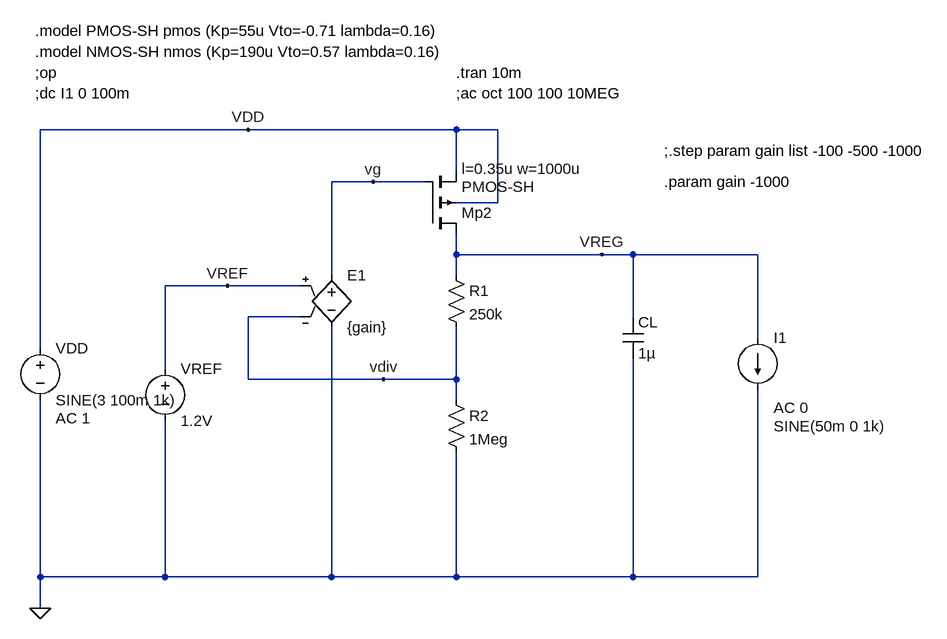
[diagram p0: schematic 5_Voltage_regulator.asc]
5_Voltage_regulator.asc, the LTspice schematic file:
Version 4
SHEET 1 1092 740
WIRE -880 -16 -1200 -16
WIRE -560 -16 -880 -16
WIRE -496 -16 -560 -16
WIRE -560 48 -560 -16
WIRE -688 64 -752 64
WIRE -608 64 -688 64
WIRE -496 96 -496 -16
WIRE -496 96 -560 96
WIRE -560 176 -560 144
WIRE -336 176 -560 176
WIRE -288 176 -336 176
WIRE -96 176 -288 176
WIRE -752 208 -752 64
WIRE -560 208 -560 176
WIRE -912 224 -1008 224
WIRE -800 224 -912 224
WIRE -800 272 -880 272
WIRE -288 272 -288 176
WIRE -96 304 -96 176
WIRE -1200 320 -1200 -16
WIRE -1008 352 -1008 224
WIRE -880 368 -880 272
WIRE -672 368 -880 368
WIRE -560 368 -560 288
WIRE -560 368 -672 368
WIRE -560 400 -560 368
WIRE -1200 672 -1200 400
WIRE -1008 672 -1008 432
WIRE -1008 672 -1200 672
WIRE -752 672 -752 288
WIRE -752 672 -1008 672
WIRE -560 672 -560 480
WIRE -560 672 -752 672
WIRE -288 672 -288 336
WIRE -288 672 -560 672
WIRE -96 672 -96 384
WIRE -96 672 -288 672
WIRE -1200 720 -1200 672
FLAG -1200 720 0
FLAG -880 -16 VDD
FLAG -912 224 VREF
FLAG -336 176 VREG
FLAG -688 64 vg
FLAG -672 368 vdiv
SYMBOL pmos4 -608 144 M180
WINDOW 123 56 100 Left 2
SYMATTR Value2 l=0.35u w=1000u
SYMATTR InstName Mp2
SYMATTR Value PMOS-SH
SYMBOL voltage -1200 304 R0
WINDOW 123 24 124 Left 2
WINDOW 39 0 0 Left 2
SYMATTR Value2 AC 1
SYMATTR InstName VDD
SYMATTR Value SINE(3 100m 1k)
SYMBOL e -752 192 R0
SYMATTR InstName E1
SYMATTR Value {gain}
SYMBOL res -576 192 R0
SYMATTR InstName R1
SYMATTR Value 250k
SYMBOL res -576 384 R0
SYMATTR InstName R2
SYMATTR Value 1Meg
SYMBOL voltage -1008 336 R0
WINDOW 123 0 0 Left 2
WINDOW 39 0 0 Left 2
SYMATTR InstName VREF
SYMATTR Value 1.2V
SYMBOL cap -304 272 R0
SYMATTR InstName CL
SYMATTR Value 1µ
SYMBOL current -96 304 R0
WINDOW 3 24 136 Left 2
WINDOW 123 24 108 Left 2
WINDOW 39 0 0 Left 2
SYMATTR Value SINE(50m 0 1k)
SYMATTR Value2 AC 0
SYMATTR InstName I1
TEXT -1208 -136 Left 2 !.model NMOS-SH nmos (Kp=190u Vto=0.57 lambda=0.16)
TEXT -1208 -104 Left 2 !;op
TEXT -1208 -168 Left 2 !.model PMOS-SH pmos (Kp=55u Vto=-0.71 lambda=0.16)
TEXT -1208 -72 Left 2 !;dc I1 0 100m
TEXT -560 -104 Left 2 !.tran 10m
TEXT -560 -72 Left 2 !;ac oct 100 100 10MEG
TEXT -240 64 Left 2 !.param gain -1000
TEXT -240 16 Left 2 !;.step param gain list -100 -500 -1000

The netlist it stands for:
* 5_Voltage_regulator.asc
Mp2 VREG vg VDD VDD PMOS-SH l=0.35u w=1000u
VDD VDD 0 SINE(3 100m 1k) AC 1
E1 vg 0 VREF vdiv {gain}
R1 VREG vdiv 250k
R2 vdiv 0 1Meg
VREF VREF 0 1.2V
CL VREG 0 1µ
I1 VREG 0 SINE(50m 0 1k) AC 0
.model NMOS NMOS
.model PMOS PMOS
.lib standard.mos
.model NMOS-SH nmos (Kp=190u Vto=0.57 lambda=0.16)
;op
.model PMOS-SH pmos (Kp=55u Vto=-0.71 lambda=0.16)
;dc I1 0 100m
.tran 10m
;ac oct 100 100 10MEG
.param gain -1000
;.step param gain list -100 -500 -1000
.backanno
.end